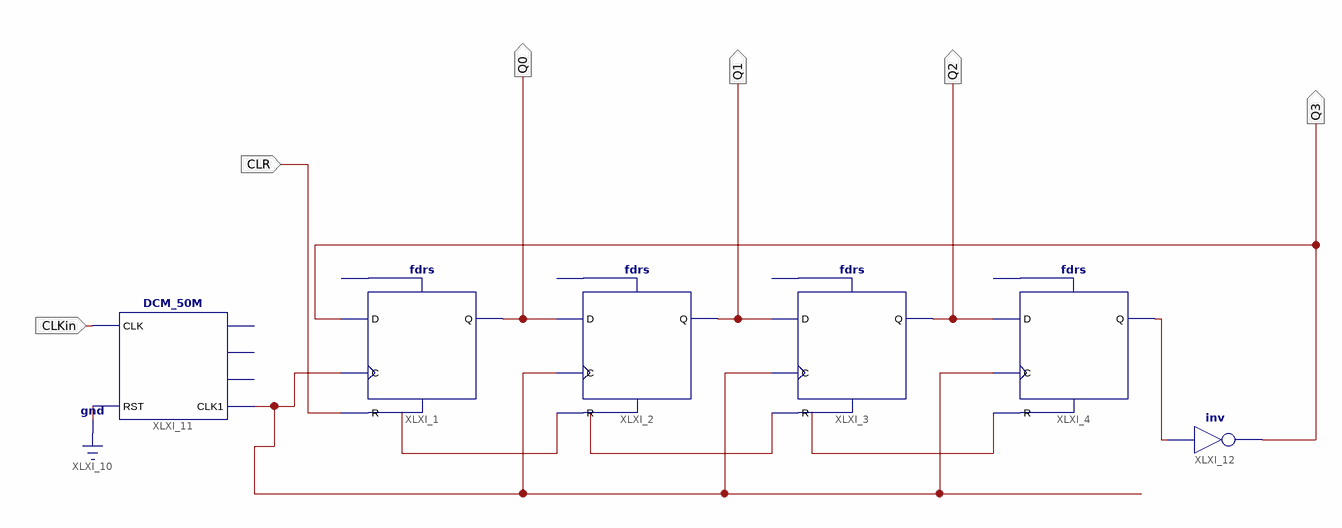
[diagram p0: schematic sheet 1]
// Xilinx ISE schematic lab7_experiment8.sch (spartan3e) as structural Verilog: 6 symbols, 6 ports
module lab7_experiment8 (
  input  CLKin,
  input  CLR,
  output Q0,
  output Q1,
  output Q2,
  output Q3
);

  wire XLXN_22, XLXN_25, XLXN_26, XLXN_27, XLXN_28;

  DCM_50M XLXI_11 (.CLK(CLKin), .RST(1'b0), .CLK1(XLXN_22));  // open: CLK1M, CLK10k, CLK1k
  fdrs XLXI_1 (.C(XLXN_22), .D(Q3), .R(CLR), .Q(Q0));  // open: S
  fdrs XLXI_2 (.C(XLXN_22), .D(Q0), .R(XLXN_25), .Q(Q1));  // open: S
  fdrs XLXI_3 (.C(XLXN_22), .D(Q1), .R(XLXN_26), .Q(Q2));  // open: S
  fdrs XLXI_4 (.C(XLXN_22), .D(Q2), .R(XLXN_27), .Q(XLXN_28));  // open: S
  not XLXI_12 (Q3, XLXN_28);
endmodule
